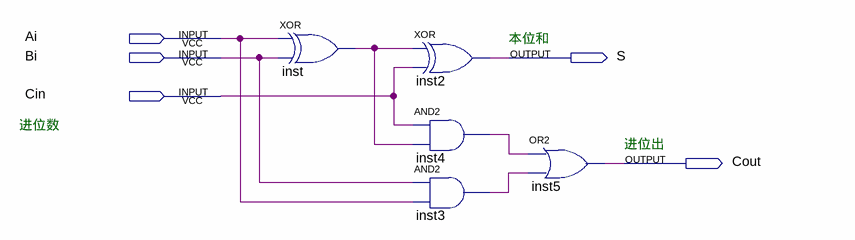
[diagram p0: schematic sheet]
// Quartus schematic FullAdder.bdf as structural Verilog: 5 symbols, 5 pins
module FullAdder (
  input  Ai,
  input  Bi,
  input  Cin,
  output S,
  output Cout
);

  wire inst3_out, inst4_out, inst_out;

  xor inst (inst_out, Ai, Bi);
  xor inst2 (S, inst_out, Cin);
  and inst4 (inst4_out, Cin, inst_out);
  and inst3 (inst3_out, Bi, Ai);
  or inst5 (Cout, inst4_out, inst3_out);

  // Notes on the sheet:
  //   本位和
  //   进位数
  //   进位出
endmodule
